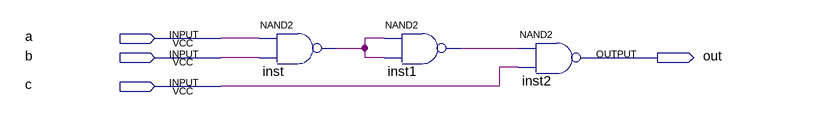
[diagram p0: schematic sheet]
// Quartus schematic Nand3-primitive.bdf as structural Verilog: 3 symbols, 4 pins
module \Nand3-primitive  (
  input  a,
  input  b,
  input  c,
  output out
);

  wire inst1_out, inst_out;

  nand inst (inst_out, a, b);
  nand inst1 (inst1_out, inst_out, inst_out);
  nand inst2 (out, inst1_out, c);
endmodule
